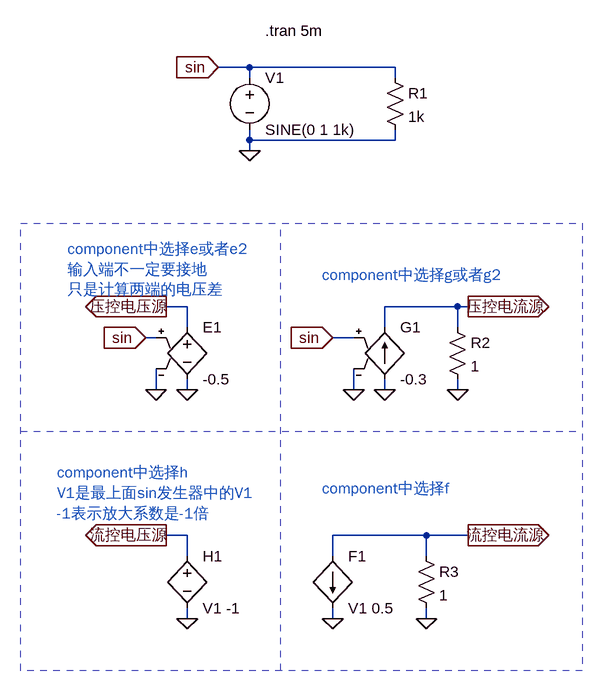
[diagram p0: schematic 09.四种受控源.asc]
09.四种受控源.asc, the LTspice schematic file:
Version 4
SHEET 1 880 1028
WIRE 48 96 0 96
WIRE 272 96 48 96
WIRE 48 112 48 96
WIRE 272 112 272 96
WIRE 48 208 48 192
WIRE 272 208 272 192
WIRE 272 208 48 208
WIRE 48 224 48 208
WIRE -48 464 -80 464
WIRE 368 464 256 464
WIRE 384 464 368 464
WIRE -48 496 -48 464
WIRE 256 496 256 464
WIRE 368 496 368 464
WIRE -96 512 -112 512
WIRE 208 512 176 512
WIRE -96 592 -96 560
WIRE -48 592 -48 576
WIRE 208 592 208 560
WIRE 256 592 256 576
WIRE 368 592 368 576
WIRE -48 816 -80 816
WIRE 320 816 176 816
WIRE 384 816 320 816
WIRE -48 848 -48 816
WIRE 176 848 176 816
WIRE 320 848 320 816
WIRE -48 944 -48 928
WIRE 176 944 176 928
WIRE 320 944 320 928
FLAG 48 224 0
FLAG 0 96 sin
IOPIN 0 96 In
FLAG -112 512 sin
IOPIN -112 512 In
FLAG -96 592 0
FLAG -48 592 0
FLAG -80 464 压控电压源
IOPIN -80 464 Out
FLAG 176 512 sin
IOPIN 176 512 In
FLAG 208 592 0
FLAG 256 592 0
FLAG 384 464 压控电流源
IOPIN 384 464 Out
FLAG 368 592 0
FLAG -80 816 流控电压源
IOPIN -80 816 Out
FLAG -48 944 0
FLAG 176 944 0
FLAG 384 816 流控电流源
IOPIN 384 816 Out
FLAG 320 944 0
SYMBOL voltage 48 96 R0
WINDOW 123 0 0 Left 0
WINDOW 39 0 0 Left 0
SYMATTR InstName V1
SYMATTR Value SINE(0 1 1k)
SYMBOL res 256 96 R0
SYMATTR InstName R1
SYMATTR Value 1k
SYMBOL e -48 480 R0
SYMATTR InstName E1
SYMATTR Value -0.5
SYMBOL g 256 480 R0
SYMATTR InstName G1
SYMATTR Value -0.3
SYMBOL res 352 480 R0
SYMATTR InstName R2
SYMATTR Value 1
SYMBOL h -48 832 R0
SYMATTR InstName H1
SYMATTR Value V1 -1
SYMBOL f 176 848 R0
SYMATTR InstName F1
SYMATTR Value V1 0.5
SYMBOL res 304 832 R0
SYMATTR InstName R3
SYMATTR Value 1
TEXT -232 376 Left 2 ;component中选择e或者e2\n输入端不一定要接地\n只是计算两端的电压差
TEXT 72 40 Left 2 !.tran 5m
TEXT 160 416 Left 2 ;component中选择g或者g2
TEXT -248 720 Left 2 ;component中选择h\nV1是最上面sin发生器中的V1\n-1表示放大系数是-1倍
TEXT 160 744 Left 2 ;component中选择f
LINE Normal -304 656 560 656 2
LINE Normal 96 1024 96 336 2
RECTANGLE Normal 560 1024 -304 336 2

The netlist it stands for:
* 09.四种受控源.asc
V1 sin 0 SINE(0 1 1k)
R1 sin 0 1k
E1 压控电压源 0 sin 0 -0.5
G1 0 压控电流源 sin 0 -0.3
R2 压控电流源 0 1
H1 流控电压源 0 V1 -1
F1 流控电流源 0 V1 0.5
R3 流控电流源 0 1
* component中选择e或者e2
* 输入端不一定要接地
* 只是计算两端的电压差
.tran 5m
* component中选择g或者g2
* component中选择h
* V1是最上面sin发生器中的V1
* -1表示放大系数是-1倍
* component中选择f
.backanno
.end